# EAGLE design amebot_arduino_adapter (EAGLE 6.5.0)
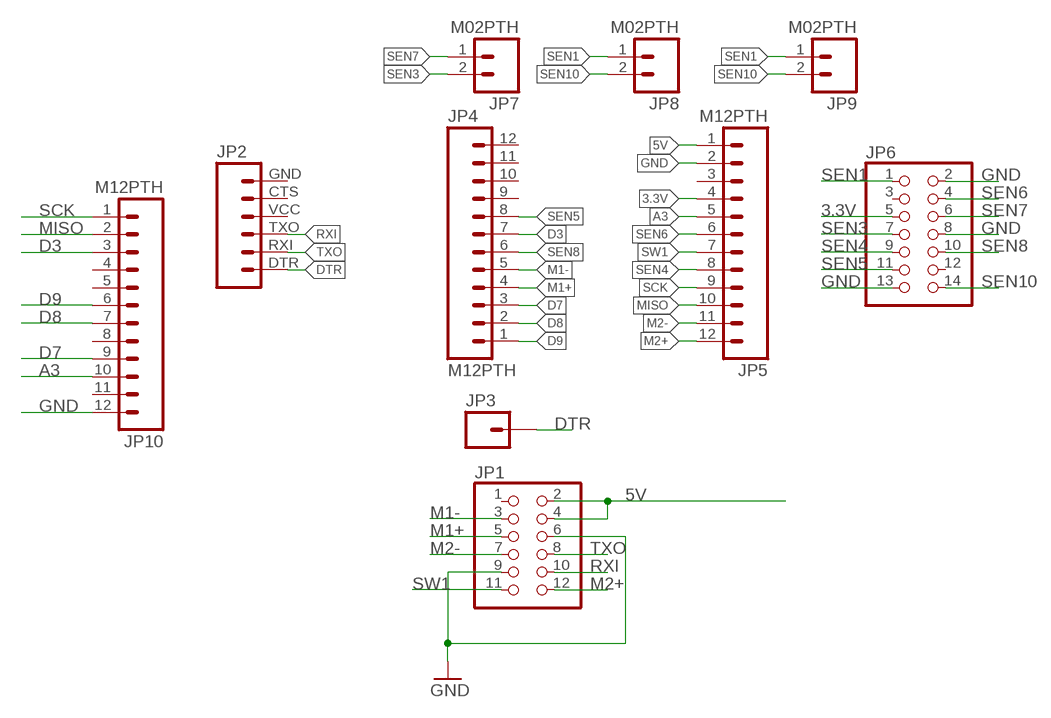
[diagram p0: schematic, sheet 1]

## Parts
JP1  PINHD-2X6  [2X06]
JP2  M06SIP  [1X06]
JP3  M01PTH_LONGPAD  [1X01_LONGPAD]
JP4  M12PTH  [1X12]
JP5  M12PTH  [1X12]
JP6  PINHD-2X7  [2X07]
JP7  M02PTH  [1X02]
JP8  M02PTH  [1X02]
JP9  M02PTH  [1X02]
JP10  M12PTH  [1X12]

## Nets
3.3V: JP5.4 JP6.5
5V: JP1.2 JP1.4 JP5.1
A3: JP5.5 JP10.10
D3: JP4.7 JP10.3
D7: JP4.3 JP10.9
D8: JP4.2 JP10.7
D9: JP4.1 JP10.6
DTR: JP2.DTR JP3.1
GND: JP1.6 JP1.9 JP5.2 JP6.2 JP6.8 JP6.13 JP10.12
M1+: JP1.5 JP4.4
M1-: JP1.3 JP4.5
M2+: JP1.12 JP5.12
M2-: JP1.7 JP5.11
MISO: JP5.10 JP10.2
RXI: JP1.10 JP2.TXO
SCK: JP5.9 JP10.1
SEN1: JP6.1 JP8.1 JP9.1
SEN3: JP6.7 JP7.2
SEN4: JP5.8 JP6.9
SEN5: JP4.8 JP6.11
SEN6: JP5.6 JP6.4
SEN7: JP6.6 JP7.1
SEN8: JP4.6 JP6.10
SEN10: JP6.14 JP8.2 JP9.2
SW1: JP1.11 JP5.7
TXO: JP1.8 JP2.RXI
Unconnected: JP1.1 JP2.CTS JP2.GND JP2.VCC JP4.9 JP4.10 JP4.11 JP4.12 JP5.3 JP6.3 JP6.12 JP10.4 JP10.5 JP10.8 JP10.11

## Library data of the parts
JP1 = pinhead:PINHD-2X6: PIN HEADER
JP2 = SparkFun-Connectors:M06: Header 6 Standard 6-pin 0.1" header. Use with straight break away headers (SKU : PRT-00116), right angle break away headers (PRT-00553), swiss pins (PRT-00743), machine pins (PRT-00117), and female headers (PRT-00115). Molex polarized connector foot print use with SKU : PRT-08094 with associated crimp pins and housings. NOTES ON THE VARIANTS LOCK and LOCK_LONGPADS... This footprint was designed to help hold the alignment of a through-hole component (i.e. 6-pin header) while soldering it into place. You may notice that each hole has been shifted either up or down by 0.005 of an inch from it's more standard position (which is a perfectly straight line). This slight alteration caused the pins (the squares in the middle) to touch the edges of the holes. Because they are alternating, it causes a "brace" to hold the component in place. 0.005 has proven to be the perfect amount of "off-center" position when using our standard breakaway headers. Although looks a little odd when you look at the bare footprint, once you have a header in there, the alteration is very hard to notice. Also,if you push a header all the way into place, it is covered up entirely on the bottom side. This idea of altering the position of holes to aid alignment will be further integrated into the Sparkfun Library for other footprints. It can help hold any component with 3 or more connection pins.
JP3 = SparkFun-Connectors:M01: Header 1 Standard 1-pin 0.1" header. Use with straight break away headers (SKU : PRT-00116), right angle break away headers (PRT-00553), swiss pins (PRT-00743), machine pins (PRT-00117), and female headers (PRT-00115).
JP4 JP5 JP10 = SparkFun-Connectors:M12: Header 12 Standard 12-pin 0.1" header. Use with straight break away headers (SKU : PRT-00116), right angle break away headers (PRT-00553), swiss pins (PRT-00743), machine pins (PRT-00117), and female headers (PRT-00115).
JP6 = pinhead:PINHD-2X7: PIN HEADER
JP7-JP9 = SparkFun-Connectors:M02: Standard 2-pin 0.1" header. Use with - straight break away headers ( PRT-00116) - right angle break away headers (PRT-00553) - swiss pins (PRT-00743) - machine pins (PRT-00117) - female headers (PRT-00115) Molex polarized connector foot print use with: PRT-08233 with associated crimp pins and housings. 2.54_SCREWTERM for use with PRT-10571. 3.5mm Screw Terminal footprints for PRT-08084 5mm Screw Terminal footprints for use with PRT-08432

## Net classes
1 vcc: width 0.254 mm

## Board
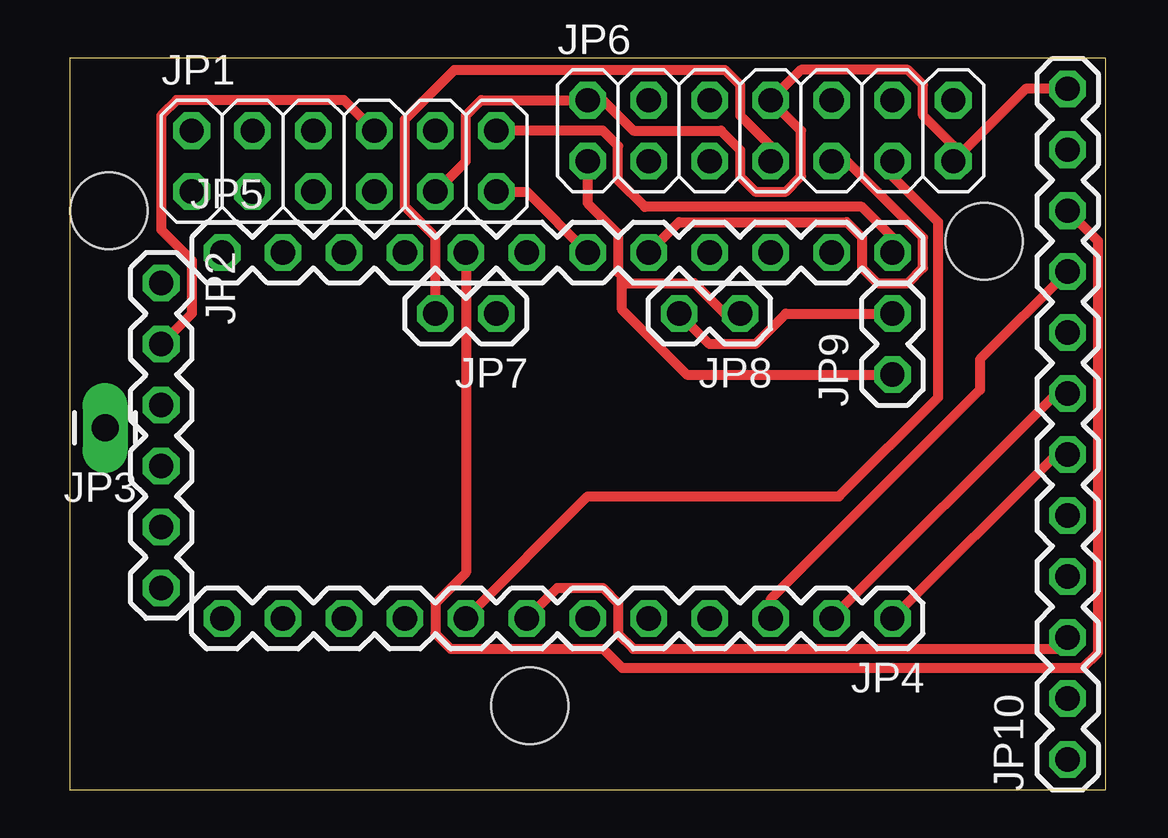
[diagram p1: board, top side]
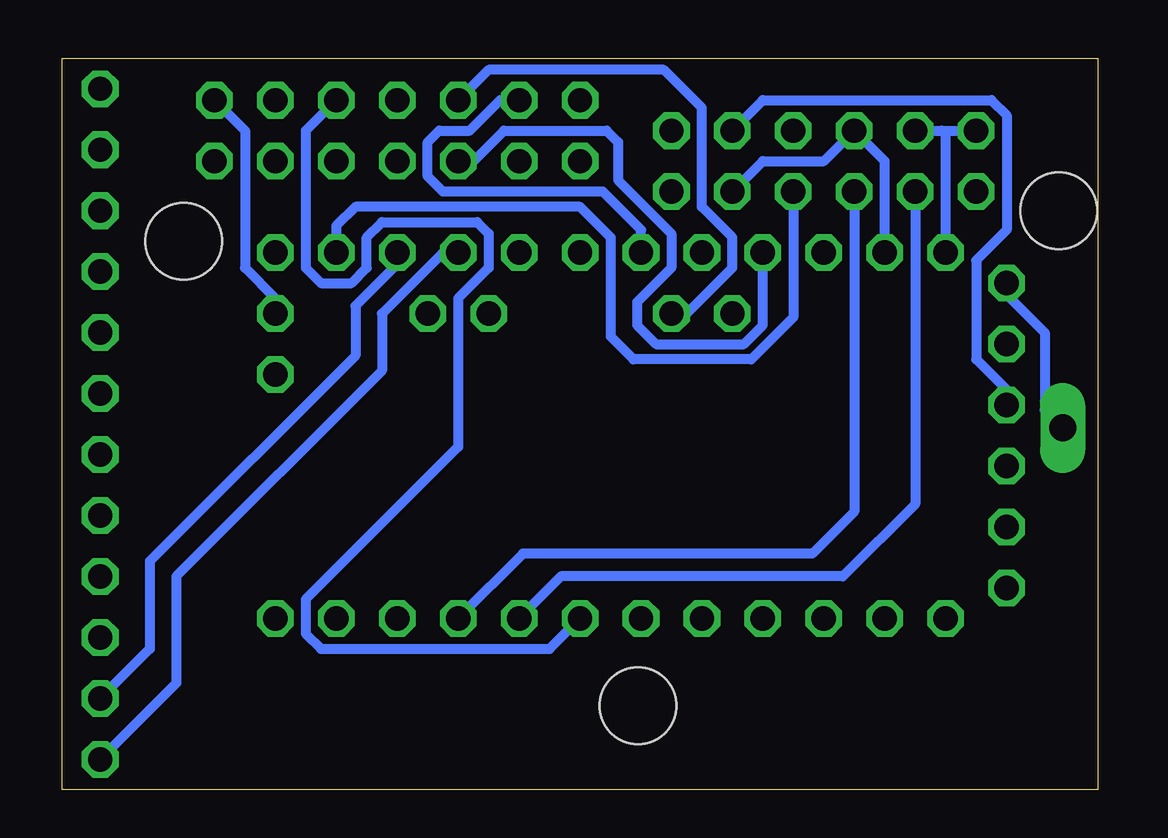
[diagram p2: board, bottom side, seen from below]

No outline drawn. Coordinates in mm, seen from the top.
Copper layers (1*16): Top 0.035mm / dielectric 1.5mm / Bottom 0.035mm
Design rules "default": minimum track width 10mil, minimum drill 24mil, track to track 8mil, track to pad 8mil, pad to pad 8mil, via to via 8mil, smd to smd 8mil, copper to edge 40mil, drill to drill 8mil, minimum pad ring 10mil, minimum via ring 8mil, stop-mask expansion 4mil, vias tented up to drill 0mil, thermal gap 10mil
Holes 3.2 mm at 1.64,24.13 38.11,22.85 19.18,3.5
Milling: 4 lines

### Footprints (pad centres in the part's own frame; a part is rotated, then mirrored left to right if it is on the bottom)
2X06 = drill 1.016 octagon: 1 -6.35,-1.27; 2 -6.35,1.27; 3 -3.81,-1.27; 4 -3.81,1.27; 5 -1.27,-1.27; 6 -1.27,1.27; 7 1.27,-1.27; 8 1.27,1.27; 9 3.81,-1.27; 10 3.81,1.27; 11 6.35,-1.27; 12 6.35,1.27
1X06 = drill 1.016 octagon: CTS 10.16,0; DTR 0,0; GND 12.7,0; RXI 2.54,0; TXO 5.08,0; VCC 7.62,0
1X01_LONGPAD = drill 1.118 pad 1.88 long: 1 0,0
1X12 = drill 1.016 octagon: 1 0,0; 2 2.54,0; 3 5.08,0; 4 7.62,0; 5 10.16,0; 6 12.7,0; 7 15.24,0; 8 17.78,0; 9 20.32,0; 10 22.86,0; 11 25.4,0; 12 27.94,0
2X07 = drill 1.016 octagon: 1 -7.62,-1.27; 2 -7.62,1.27; 3 -5.08,-1.27; 4 -5.08,1.27; 5 -2.54,-1.27; 6 -2.54,1.27; 7 0,-1.27; 8 0,1.27; 9 2.54,-1.27; 10 2.54,1.27; 11 5.08,-1.27; 12 5.08,1.27; 13 7.62,-1.27; 14 7.62,1.27
1X02 = drill 1.016 octagon: 1 0,0; 2 2.54,0

### Placement (x,y rotation side)
JP1  11.43,26.19 0 top
JP2  3.81,21.11 270 top
JP3  1.47,15.08 180 top
JP4  34.29,7.14 180 top
JP5  6.35,22.38 0 top
JP6  29.21,27.46 0 top
JP7  17.78,19.84 180 top
JP8  27.94,19.84 180 top
JP9  34.29,17.3 90 top
JP10  41.59,1.27 90 top

### Tracks (layer width: path | path; a pad name or v marks a point on that pad's centre or on a via)
3.3V
  Bottom 0.406: JP6.5 26.04,26.19 24.77,27.46 20.48,27.46 20,26.99 20,25.4 17.78,23.18 17.78,21.75 19.21,20.32 19.21,19.37 18.41,18.57 14.76,18.57 13.97,19.37 JP5.4
5V
  Bottom 0.406: JP1.4 6.51,27.46 | 6.51,27.46 JP1.2 | JP5.1 6.35,27.3 6.51,27.46
A3
  Top 0.406: JP5.5 16.51,9.05 15.24,7.78 15.24,6.51 15.88,5.87 22.23,5.87 23.02,5.08 42.23,5.08 42.86,5.71 42.86,22.86 JP10.10
D3
  Top 0.406: JP4.7 20.32,8.41 22.23,8.41 22.86,7.78 22.86,6.51 23.5,5.87 41.12,5.87 JP10.3
D7
  Top 0.406: JP10.9 37.94,17.94 37.94,16.67 29.21,7.94 JP4.3
D8
  Top 0.406: JP10.7 41.12,16.51 JP4.2
D9
  Top 0.406: JP10.6 41.12,13.97 JP4.1
DTR
  Bottom 0.406: JP2.DTR 3.81,20.64 2.22,19.05 2.22,15.83 JP3.1
GND
  Top 0.406: JP1.9 16.51,26.19 16.51,28.1 17.14,28.73 JP6.2 22.23,28.73 23.5,27.46 27.15,27.46 27.94,26.67 27.94,25.56 28.57,24.92 29.84,24.92 30.48,25.56 30.48,27.46 JP6.8 30.48,30 34.92,30 35.56,29.37 35.56,28.1 36.83,26.83 JP6.13 39.85,29.21 JP10.12
  Bottom 0.406: JP1.9 13.97,26.19 11.43,26.19 JP1.6 8.89,26.19 JP5.2
M1+
  Bottom 0.406: JP1.5 10.16,11.59 11.91,9.84 23.97,9.84 JP4.4
M1-
  Bottom 0.406: JP1.3 7.62,11.91 10.64,8.89 22.38,8.89 JP4.5
M2+
  Top 0.406: JP5.12 34.29,23.02 33.02,24.29 23.97,24.29 22.86,25.4 22.86,26.83 22.23,27.46 JP1.12
M2-
  Bottom 0.406: JP1.7 12.7,19.68 14.45,17.94 19.37,17.94 20.32,18.89 20.32,23.02 21.59,24.29 30.96,24.29 31.75,23.5 JP5.11
MISO
  Bottom 0.406: JP5.10 29.21,21.91 30.96,20.16 30.96,18.1 39.53,9.53 39.53,5.87 JP10.2
RXI
  Bottom 0.406: JP1.10 13.97,28.73 4.45,28.73 3.81,28.1 3.81,23.34 5.08,22.07 5.08,17.94 3.81,16.67 JP2.TXO
SCK
  Bottom 0.406: JP5.9 27.3,22.38 29.84,19.84 29.84,17.46 38.42,8.89 38.42,4.45 JP10.1
SEN1
  Top 0.406: JP8.1 27.3,19.84 26.04,21.11 23.02,21.11 | JP9.1 25.72,17.3 23.02,20 23.02,21.11 | JP6.1 21.59,24.45 22.86,23.18 22.86,21.59 23.02,21.43 23.02,21.11
SEN3
  Top 0.406: JP7.2 15.24,23.02 13.97,24.29 13.97,27.94 16.03,30 27.3,30 27.94,29.37 27.94,28.1 29.21,26.83 JP6.7
SEN4
  Top 0.406: JP5.8 25.4,23.65 32.38,23.65 33.02,23.02 33.02,21.75 33.66,21.11 34.92,21.11 35.56,21.75 35.56,23.02 32.38,26.19 JP6.9
SEN5
  Top 0.406: JP4.8 21.59,12.22 32.07,12.22 36.2,16.35 36.2,23.65 34.29,25.56 JP6.11
SEN6
  Bottom 0.406: JP5.6 19.05,23.34 20.64,24.92 27.3,24.92 27.94,25.56 27.94,26.99 27.46,27.46 26.19,27.46 24.92,28.73 JP6.4
SEN7
  Bottom 0.406: JP7.1 17.14,19.84 15.24,21.75 15.24,23.02 16.51,24.29 16.51,28.42 18.1,30 25.4,30 JP6.6
SEN8
  Bottom 0.406: JP6.10 33.02,27.46 33.02,21.75 32.38,21.11 31.11,21.11 30.48,21.75 30.48,23.02 29.84,23.65 25.88,23.65 25.4,23.18 25.4,21.75 26.67,20.48 26.67,14.29 33.02,7.94 33.02,6.51 32.38,5.87 22.86,5.87 JP4.6
SEN10
  Top 0.406: JP8.2 26.67,18.57 28.57,18.57 29.84,19.84 JP9.2
  Bottom 0.406: JP6.14 35.56,27.46 35.56,21.75 34.29,20.48 JP9.2
SW1
  Top 0.406: JP1.11 19.05,24.92 JP5.7
TXO
  Top 0.406: JP1.8 11.43,28.73 4.45,28.73 3.81,28.1 3.81,23.34 5.08,22.07 5.08,19.84 JP2.RXI